# Altium schematic sheet H03R0x_Frontend.SchDoc
size Letter; CompanyName: Hexabitz; DocumentNumber: 3; SheetNumber: 1; SheetTotal: 1
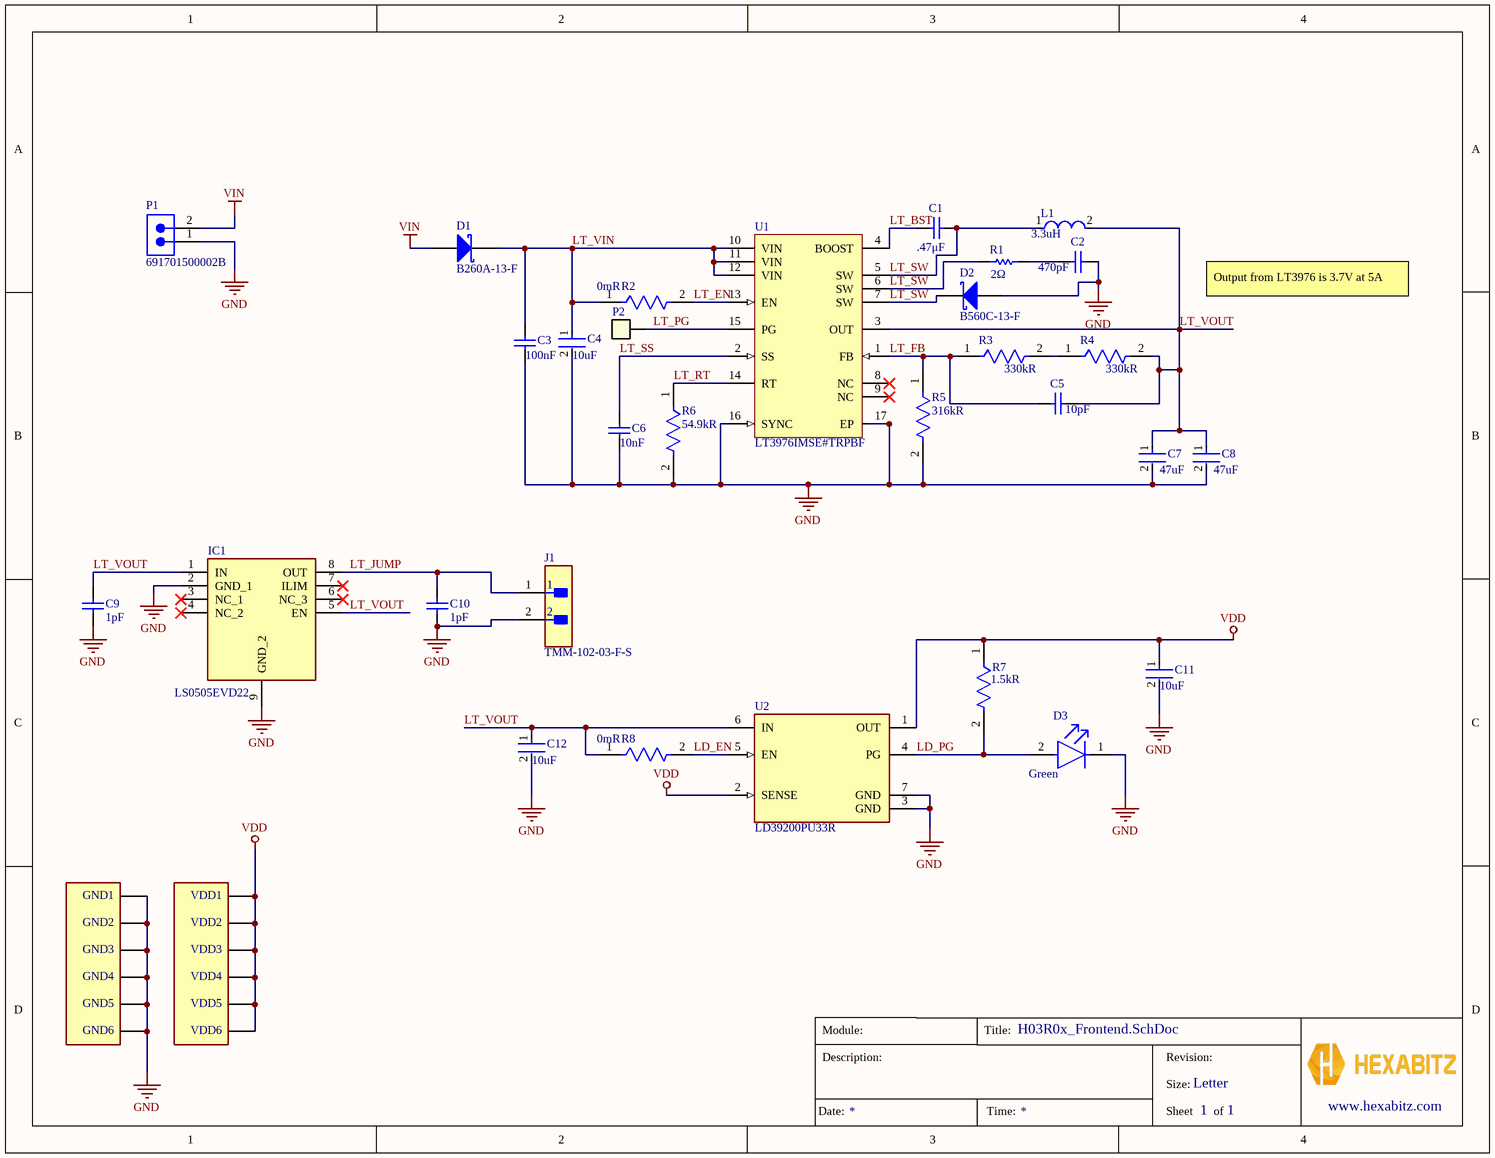
[diagram p0: H03R0x_Frontend.SchDoc]

## Parts
C1  Capacitance: .47μF  [CAPC2013X145X50LL20T20]  (hidden comment: VJ0805Y474KXQRW1BC)
C2  Capacitance: 470pF  [CAPC2013X94X50NL20T25]  (hidden comment: 08055C471KAT4A)
C3  Capacitance: 100nF  [CAPC2013X94X50NL20T25]  (hidden comment: 08055C104KAZ2A)
C4  Capacitance: 10uF  [FP-GRM32-MFG]  (hidden comment: GRM32ER71H106KA12L)
C5  Capacitance: 10pF  [CAPC2013X94X50LL20T25]  (hidden comment: 08051A100JAT4A)
C6  Capacitance: 10nF  [CAPC2013X94X50ML20T25]  (hidden comment: 0805YC103MAT2A)
C7  Capacitance: 47uF  [FP-GRM32E-0_3-0_2-MFG]  (hidden comment: GRM32ED71A476KE15L)
C8  Capacitance: 47uF  [FP-GRM32E-0_3-0_2-MFG]  (hidden comment: GRM32ED71A476KE15L)
C9  Capacitance: 1pF  [CAPC1508X91X25LL25T13]  (hidden comment: 06032U1R0BAT2A)
C10  Capacitance: 1pF  [CAPC1508X91X25LL25T13]  (hidden comment: 06032U1R0BAT2A)
C11  Capacitance: 10uF  [FP-GRM32-MFG]  (hidden comment: GRM32ER71H106KA12L)
C12  Capacitance: 10uF  [FP-GRM32-MFG]  (hidden comment: GRM32ER71H106KA12L)
D1  B260A-13-F  [DIOD-SMA-2_V]
D2  B560C-13-F  [DIOD-B5X0C-2_M]
D3  Illumination Color: Green  [FP-APHCM2012CGCK-F01-MFG]  (hidden comment: APHCM2012CGCK-F01)
GND1  HEXABIT_UART_PORT  [HEXABIT_POWER_PORT_D]  (value not drawn)  (no BOM)
GND2  HEXABIT_UART_PORT  [HEXABIT_POWER_PORT_D]  (value not drawn)  (no BOM)
GND3  HEXABIT_UART_PORT  [HEXABIT_POWER_PORT_D]  (value not drawn)  (no BOM)
GND4  HEXABIT_UART_PORT  [HEXABIT_POWER_PORT_D]  (value not drawn)  (no BOM)
GND5  HEXABIT_UART_PORT  [HEXABIT_POWER_PORT_D]  (value not drawn)  (no BOM)
GND6  HEXABIT_UART_PORT  [HEXABIT_POWER_PORT_D]  (value not drawn)  (no BOM)
IC1  LS0505EVD22  [SON50P200X200X80-9N]
J1  TMM-102-03-F-S  [FP-TMM-102-03-F-S-MFG]
L1  Inductance: 3.3uH  [FP-MLZ2012-0_85-IPC_C]  (hidden comment: MLZ2012A3R3WT000)
P1  691701500002B  [691701500002B]
P2  Pad1  [TESTPOINT_1P4MM_SQ]  (value not drawn)
R1  Resistance: 2Ω  [RESC2013X50X30NL20T20]  (hidden comment: CRCW08052R00FNEA)
R2  Resistance: 0mR  [FP-RMCF0805-MFG]  (hidden comment: RMCF0805ZT0R00)
R3  Resistance: 330kR  [FP-CRCW0805-e3-MFG]  (hidden comment: CRCW0805330KFKEA)
R4  Resistance: 330kR  [FP-CRCW0805-e3-MFG]  (hidden comment: CRCW0805330KFKEA)
R5  Resistance: 316kR  [FP-RC2012-IPC_C]  (hidden comment: RC2012F3163CS)
R6  Resistance: 54.9kR  [FP-CR0805-MFG]  (hidden comment: CR0805-FX-5492ELF)
R7  Resistance: 1.5kR  [FP-RMCF0805-IPC_A]  (hidden comment: RMCF0805JT1K50)
R8  Resistance: 0mR  [FP-RMCF0805-MFG]  (hidden comment: RMCF0805ZT0R00)
U1  LT3976IMSE#TRPBF  [LT-MSE-16-EDP_M]
U2  LD39200PU33R  [FP-DFN6-7946637-MFG]
VDD1  HEXABIT_UART_PORT  [HEXABIT_POWER_PORT_U]  (value not drawn)  (no BOM)
VDD2  HEXABIT_UART_PORT  [HEXABIT_POWER_PORT_U]  (value not drawn)  (no BOM)
VDD3  HEXABIT_UART_PORT  [HEXABIT_POWER_PORT_U]  (value not drawn)  (no BOM)
VDD4  HEXABIT_UART_PORT  [HEXABIT_POWER_PORT_U]  (value not drawn)  (no BOM)
VDD5  HEXABIT_UART_PORT  [HEXABIT_POWER_PORT_U]  (value not drawn)  (no BOM)
VDD6  HEXABIT_UART_PORT  [HEXABIT_POWER_PORT_U]  (value not drawn)  (no BOM)

## Nets
GND: C2.2 C3.2 C4.2 C6.2 C7.2 C8.2 C9.2 C10.2 C11.2 C12.2 D2.2(A) D3.1(C) GND1.Pwr_D GND2.Pwr_D GND3.Pwr_D GND4.Pwr_D GND5.Pwr_D GND6.Pwr_D IC1.2(GND_1) IC1.9(GND_2) J1.2 P1.1 R5.2 R6.2 U1.16(SYNC) U1.17(EP) U2.3(GND) U2.7(GND)
VDD: C11.1 R7.1 U2.1(OUT) U2.2(SENSE) VDD1.Pwr_U VDD2.Pwr_U VDD3.Pwr_U VDD4.Pwr_U VDD5.Pwr_U VDD6.Pwr_U
VIN: D1.1(A) P1.2
LD_EN: R8.2 U2.5(EN)
LD_PG: D3.2(A) R7.2 U2.4(PG)
LT_BST: C1.2 U1.4(BOOST)
LT_EN: R2.2 U1.13(EN)
LT_FB: C5.1 R3.1 R5.1 U1.1(FB)
LT_JUMP: C10.1 IC1.8(OUT) J1.1
LT_PG: P2.1 U1.15(PG)
LT_RT: R6.1 U1.14(RT)
LT_SS: C6.1 U1.2(SS)
LT_SW: C1.1 D2.1(K) L1.1 R1.2 U1.5(SW) U1.6(SW) U1.7(SW)
LT_VIN: C3.1 C4.1 D1.2(K) R2.1 U1.10(VIN) U1.11(VIN) U1.12(VIN)
LT_VOUT: C5.2 C7.1 C8.1 C9.1 C12.1 IC1.1(IN) IC1.5(EN) L1.2 R4.2 R8.1 U1.3(OUT) U2.6(IN)
NetC2_1: C2.1 R1.1
NetR3_2: R3.2 R4.1

Not connected (* = marked no-connect by the designer): IC1 3(NC_1)* 4(NC_2)* 6(NC_3)* 7(ILIM)*; U1 8(NC)* 9(NC)*

## Notes on the sheet
- Input Accepts absolute min of 6V and absolute max of 40V, safe input limit is 9V and safe max is 30V.
- (near D1) Diode added as Reverse Voltage protection for input
- Output from LT3976 is 3.7V at 5A
- (near P2) Changed test pad to Hexabitz library pad
- (near IC1) Efuse Accepts min of 2.6V and outputs 5V with a 5A max before current limiting kicks in.
- (near C7) Output Voltage Controlled by FB Voltage Divider.
  Output Set to approx. 3.7
  VOUT​=1.197(1+R2​/R1​​)
  VOUT = 1.197(1+660k/316k) = 3.7V
- (near C11) R_LED ≈ (3.3 – V_F)/I ≈ (3.3 – 2.1)/1 mA ≈ 1.2 kΩ → use 1.5 kΩ
- Final output is 3.3V at 2A
- Module:
- Title:
- Description:
- Size:
- Revision:
- Letter
- www.hexabitz.com
- Date:
- Time:
- Sheet
- of

## Library data of the parts
C1 = CMP-2007-01617-1: Manufacturer: Vitramon; Part Number: VJ0805Y474KXQRW1BC
C2 = CMP-2007-04419-1: Manufacturer: AVX Interconnect / Elco; Part Number: 08055C471KAT4A
C3 = CMP-2007-04372-1: Manufacturer: AVX Interconnect / Elco; Part Number: 08055C104KAZ2A
C4 C11 C12 = CMP-2000-05261-2: CAP CER 10UF 50V X7R 1210; Manufacturer: Murata; Tolerance: 10%; Material: Ceramic; Temperature Coefficient: 15%; Voltage Rating: 50V; Temperature Characteristic: X7R; Value: 10uF; ComponentLink2Description: Datasheet; Device Class L1: Passive Components; Lead Free: Yes; Temperature Range High: +125°C; Category: Cap; Manufacturer Part Number: GRM32ER71H106KA12L; ComponentLink2URL: https://search.murata.co.jp/Ceramy/image/img/A01X/G101/ENG/GRM32ER71H106KA12-01.pdf; Device Class L2: Capacitors; Package: GRM32; Mouser Description: 1210 10 uF 50 V ±10% Tolerance X7R SMT Multilayer Ceramic Capacitor; Octopart: https://octopart.com/grm32er71h106ka12l-murata-10470987; Digikey Description: CAP CER 10UF 50V X7R 1210; Height: 2.7mm; Temperature: -55°C to +125°C; Temperature Range Low: -55°C; RoHS: TRUE; Device Class L3: Ceramic Capacitors; Automotive: No
C5 = CMP-2007-04117-1: Manufacturer: AVX Interconnect / Elco; Part Number: 08051A100JAT4A
C6 = CMP-2007-04453-1: Manufacturer: AVX Interconnect / Elco; Part Number: 0805YC103MAT2A
C7 C8 = CMP-06035-032018-1: Chip Multilayer Ceramic Capacitors for General Purpose, 1210, 47uF, X7T, +22%/-33%, 10%, 10V; Packaging: Tape and Reel; Package Quantity: 1000; Mount: Surface Mount; Thickness: 0.106inch; Max Operating Temperature: 125°C; Dielectric: X7T; Weight: 0.00388oz; Voltage Rating (DC): 10V; Termination: SMD/SMT; Case Code (Metric): 3225; Case/Package: 1210; Case Code (Imperial): 1210; Min Operating Temperature: -55°C; Width: 0.098inch; Tolerance: 10%; Length: 0.126inch; Height: 2.5mm; Voltage Rating: 10V
C9 C10 = CMP-2006-04662-1: Manufacturer: AVX Interconnect / Elco; Part Number: 06032U1R0BAT2A
D1 = CMP-2000-04933-1: Schottky Barrier Rectifier, 60 V, 2 A, -65 to 150 degC, 2-Pin SMA, RoHS, Tape and Reel; If - Forward Current: 2A; Vf - Forward Voltage: 0.7V; Ir - Reverse Current: 500uA; Configuration: Single; Unit Weight: 0.002258oz; Brand: DiodesIncorporated; Vrrm - Repetitive Reverse Voltage: 60V; Ifsm - Forward Surge Current: 50A; Product Category: SchottkyDiodes&Rectifiers; Datasheet Version: Rev. 22-2, 07/2015; Maximum Operating Temperature: +150C; Product: SchottkyDiodes; Minimum Operating Temperature: -65C; Operating Temperature Range: -65Cto+150C; Termination Style: SMD/SMT; Package / Case: SMA; Factory Pack Quantity: 5000; Technology: Si; Height: 2.1mm; Type: SchottkyBarrierRectifier; Manufacturer URL: http://www.diodes.com/; Datasheet URL: http://www.diodes.com/_files/datasheets/ds13004.pdf; RoHS: True; Mounting Style: SMD/SMT; Length: 4.6mm; Series: B260; Package Reference: SMA-2; Packaging: Reel; Width: 2.92mm; Manufacturer: DiodesIncorporated; Package Description: 2-Pin Surface Mounted Assembly, Body 4.3 x 2.605 mm, Height 2.4 mm
D2 = CMP-2000-05098-2: Schottky Barrier Rectifier, 5 A, 60 V, -55 to 125 degC, 2-Pin SMD, RoHS, Tape and Reel; Ir - Reverse Current: 500uA; Configuration: Single; Ifsm - Forward Surge Current: 100A; Vrrm - Repetitive Reverse Voltage: 60V; Brand: DiodesIncorporated; Vf - Forward Voltage: 0.7V; If - Forward Current: 5A; Unit Weight: 0.007408oz; Type: SchottkyBarrierRectifier; Package / Case: SMC; Manufacturer URL: http://www.diodes.com/; Datasheet URL: https://datasheet.ciiva.com/27052/1538961-27052355.pdf; Factory Pack Quantity: 3000; Height: 2.5mm; Width: 6.22mm; Product Category: SchottkyDiodes&Rectifiers; Minimum Operating Temperature: -55C; Manufacturer: DiodesIncorporated; Datasheet Version: Rev. 7-2, 06/2007; Product: SchottkyDiodes; Maximum Operating Temperature: +125C; Operating Temperature Range: -55Cto+125C; Technology: Si; Length: 7.11mm; RoHS: True; Packaging: Reel; Termination Style: SMD/SMT; Series: B560; Mounting Style: SMD/SMT
D3 = CMP-44529-000062-1: LED GREEN CLEAR CHIP SMD; Dominant Wavelength: 570nm; Forward Current: 20mA; Number of LEDs: 1; Luminous Intensity: 40mcd; Forward Voltage: 2.1V; Viewing Angle: 110°; Lens Style: Clear; Mount: Surface Mount; Length: 2mm; Max Operating Temperature: 85°C; Series: APHCM; Width: 1.25mm; Lead Free: Lead Free; Wavelength: 570nm; Package Quantity: 1; Number of Pins: 2; Case Code (Metric): 2012; RoHS Compliant: Yes; Packaging: Tape and Reel; Lens Color: Clear; Case/Package: 0805; Case Code (Imperial): 0805; Test Current: 20mA; Color: Green; Min Operating Temperature: -40°C; Height: 0.4mm
GND1-GND6 = HEXABIT_POWER_PORT_D
IC1 = LS0505EVD22: Integrated Circuit; Manufacturer_Name: LITTELFUSE; Datasheet Link: https://www.littelfuse.com/media?resourcetype=datasheets&itemid=1bf74099-32be-4af5-b3e1-7da02015becb&filename=littelfuse-over-voltage-protection--ls0505evd22-datasheet-(1); Height: 0.8mm; Manufacturer_Part_Number: LS0505EVD22; Mouser Part Number: 576-LS0505EVD22; Mouser Price/Stock: https://www.mouser.co.uk/ProductDetail/Littelfuse/LS0505EVD22?qs=4ASt3YYao0X%252Bg2o9Wvd%2Ftg%3D%3D; Arrow Part Number: LS0505EVD22; Arrow Price/Stock: https://www.arrow.com/en/products/ls0505evd22/littelfuse?region=nac
J1 = CMP-02766-001614-1: CONN HEADER VERT 2POS 2MM; Number of Contacts: 2; Gender: Male; Pitch: 2mm; Packaging: Bulk; RoHS Compliant: Yes; Termination: Solder; Contact Plating: Gold; Mount: Through Hole; Number of Rows: 1; Radiation Hardening: No; Lead Free: Lead Free
L1 = CMP-08253-000308-1: Shielded Multilayer Inductor 3.3uH ±20% 450mA 442mΩ SMD 0805; Saturation Current: 200mA; Self Resonant Frequency: 90MHz; DC Resistance (DCR): 442mR; Core Material: Ferrite; Test Frequency: 10MHz; Current Rating: 450mA; Shielding: Shielded; Lead Free: Lead Free; Length: 0.079inch; Max Operating Temperature: 125°C; Height - Seated (Max): 0.041inch; Tolerance: 20%; Mount: Surface Mount; Package Quantity: 1; Case/Package: 0805; Case Code (Metric): 2012; Min Operating Temperature: -55°C; Packaging: Cut Tape; RoHS Compliant: Yes; Case Code (Imperial): 0805; Width: 0.049inch
P1 = CMP-1502-02318-2: NexarPartId: 22866741; Voltage Rating: 300V; Connector Type: Terminal Block; Gender: Male; Pitch: 5.08mm; Number of Contacts: 2; Current Rating: 10A; Length: 9.76mm; Contact Plating: Tin; Contact Gender: Male; RoHS: Compliant; Max Operating Temperature: 105°C; Mount: Through Hole; REACH SVHC: Unknown; Housing Material: Polymer; Lead Pitch: 5.08mm; Min Operating Temperature: -40°C; Termination: PCB; Number of Pins: 2; Color: Black; Contact Material: Brass
P2 = CMP-030-000029-1: Pad  2.5mm *  2.5mm; Library: Hexabitz; Pin Count: 1; Component Type: Standard; Source: Connectors.SchLib; Design Item ID: Pad1
R1 = CMP-2001-03791-1: Manufacturer: Vishay Dale; Part Number: CRCW08052R00FNEA
R2 R8 = CMP-26527-000017-1: RES 0 OHM JUMPER 1/8W 0805; Power Rating: 125mW; Depth: 1.25mm; Length: 2mm; Military Standard: Not; Width: 0.049inch; Case Code (Imperial): 0805; Number of Terminations: 2; Mount: Surface Mount; Contact Plating: Tin; Height: 0.026inch; Case/Package: 0805; Min Operating Temperature: -55°C; Composition: Thick Film; Max Operating Temperature: 155°C; Packaging: Tape and Reel; Features: Automotive AEC-Q200; Max Power Dissipation: 125mW; Radiation Hardening: No; Lead Free: Lead Free; Case Code (Metric): 2012
R3 R4 = CMP-2001-03821-2: RES Thick Film, 330kΩ, 1%, 0.125W, 100ppm/°C, 0805; Power Rating: 125mW; Voltage Rating (DC): 150V; Case Code (Metric): 2012; Contact Plating: Tin; Composition: Thick Film; Length: 2mm; Radiation Hardening: No; Height: 0.45mm; Max Operating Temperature: 155°C; Lead Free: Lead Free; Packaging: Tape and Reel; Depth: 1.25mm; Tolerance: 1%; Width: 1.25mm; Termination: SMD/SMT; Case Code (Imperial): 0805; Case/Package: 0805; Voltage Rating: 150V; Weight: 0.000194oz; Package Quantity: 5000; Temperature Coefficient: 100ppm/°C; Military Standard: Not; Min Operating Temperature: -55°C
R5 = CMP-13261-004620-1: Res Thick Film 0805 316kΩ 1% 0.125W ±100ppm/°C Molded SMD T/R; Voltage Rating (DC): 150V; Power Rating: 125mW; Contact Plating: Tin; Lead Free: Lead Free; Military Standard: Not; Temperature Coefficient: 100ppm/°C; Case Code (Imperial): 0805; Number of Terminations: 2; Width: 0.049inch; Radiation Hardening: No; Packaging: Tape and Reel; Composition: Thick Film; Case Code (Metric): 2012; Min Operating Temperature: -55°C; Max Operating Temperature: 155°C; Features: Moisture Resistant; Depth: 1.25mm; Length: 2mm; Height: 0.024inch; Tolerance: 1%; Case/Package: 0805; Max Power Dissipation: 125mW
R6 = CMP-07231-002869-1: Thick Film Chip Resistors 0805 54.9kΩ 0.125W 1% 100ppm/°C; Voltage Rating: 150V; Power Rating: 125mW; Contact Plating: Tin; Thickness: 508um; Military Standard: Not; Height: 0.5mm; Max Operating Temperature: 155°C; Radiation Hardening: No; Composition: Thick Film; Case Code (Metric): 2012; Depth: 1.25mm; Case Code (Imperial): 0805; Length: 2mm; Case/Package: 0805; Termination: SMD/SMT; Width: 1.25mm; Temperature Coefficient: 100ppm/°C; Min Operating Temperature: -55°C; Packaging: Tape and Reel; Tolerance: 1%; Mount: Surface Mount; Package Quantity: 5000
R7 = CMP-26527-000060-1: 1.5kΩ ±5% 0.125W 0805 Thick Film Chip Resistor AEC-Q200 compliant; Power Rating: 125mW; Temperature Coefficient: 100ppm/°C; Tolerance: 5%; Radiation Hardening: No; Width: 0.049inch; Mount: Surface Mount; RoHS Compliant: Yes; Length: 0.079inch; Series: RMCF; Case Code (Metric): 2012; Contact Plating: Tin; Size Code: 0805; Resistor Type: Thick Film; Construction: Rectangular; Case/Package: 0805; Min Operating Temperature: -55°C; Max Power Dissipation: 125mW; Lead Free: Lead Free; Height: 0.026inch; Features: Automotive AEC-Q200; Number of Terminations: 2; Depth: 1.25mm; Packaging: Tape and Reel; Max Operating Temperature: 155°C; Military Standard: Not; Case Code (Imperial): 0805
U1 = CMP-019-00049-1: LT3976 - 40V, 5A, 2MHz Step-Down Switching Regulator with 3.3μA Quiescent Current; Output Voltage: 38.8V; Pins: 16; Output Current: 5A; Max Operating Temperature: 125°C; Min Operating Temperature: -40°C
U2 = CMP-12153-000011-1: IC REG LINEAR 3.3V 2A 6DFN; Number of Outputs: 1; Max Input Voltage: 6V; Output Type: Fixed; Min Input Voltage: 1.25V; Dropout Voltage: 130mV; Operating Supply Current: 1mA; Number of Regulators: 1; Case/Package: DFN; Packaging: Tape and Reel; Output Current: 2A; Min Operating Temperature: -40°C; Mount: Surface Mount; Output Voltage: 3.3V; Max Operating Temperature: 125°C; Lead Free: Lead Free; Package Quantity: 3000
VDD1-VDD6 = HEXABIT_POWER_PORT_U